# EAGLE schematic suiveur_evan (EAGLE 5.12)
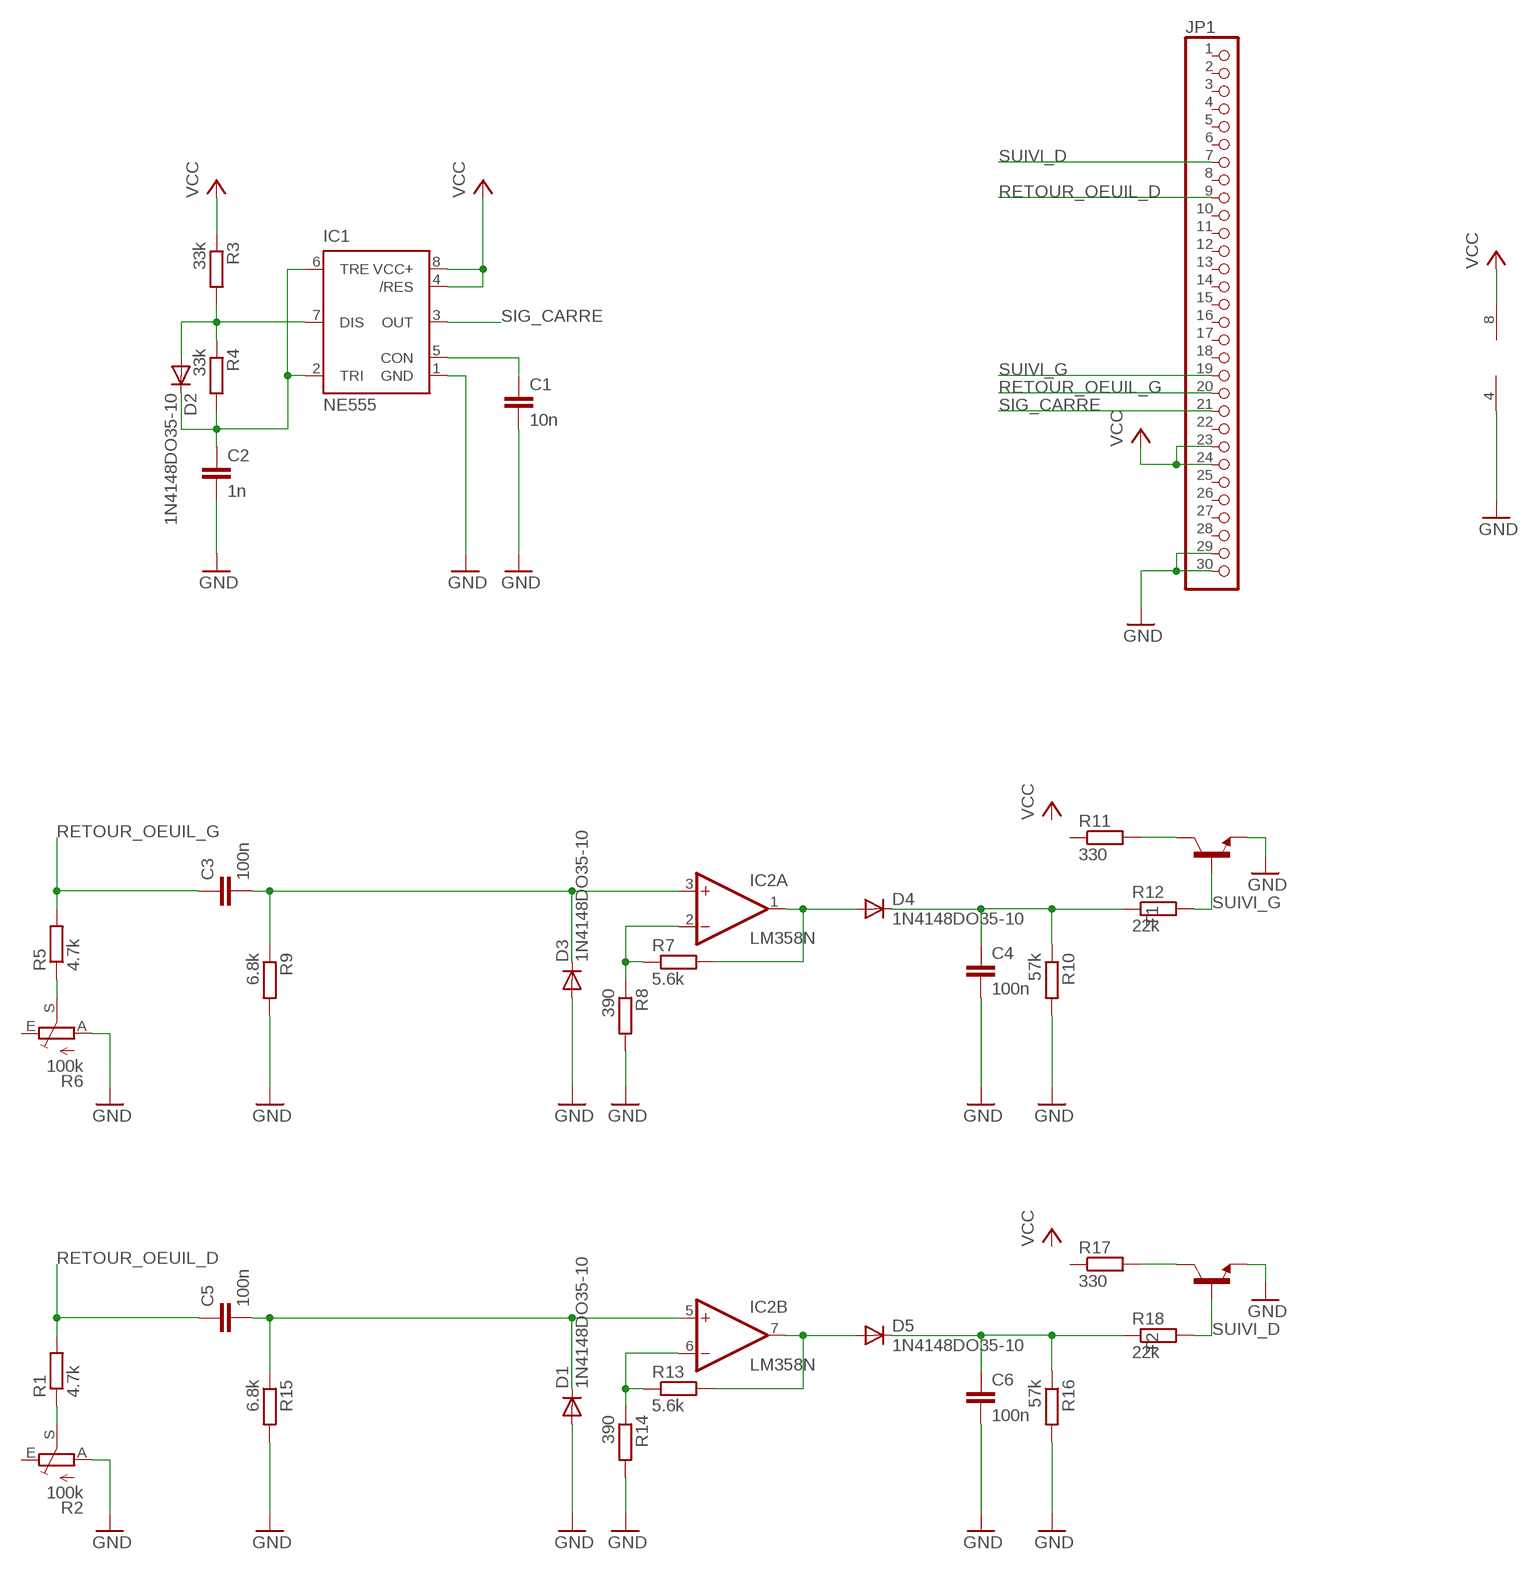
[diagram p0: schematic, sheet 1]

## Parts
C1  10n  C-EU025-025X050  [C025-025X050]
C2  1n  C-EU102-043X133  [C102-043X133]
C3  100n  C-EU025-025X050  [C025-025X050]
C4  100n  C-EU025-025X050  [C025-025X050]
C5  100n  C-EU025-025X050  [C025-025X050]
C6  100n  C-EU025-025X050  [C025-025X050]
D1  1N4148DO35-10  [DO35-10]
D2  1N4148DO35-10  [DO35-10]
D3  1N4148DO35-10  [DO35-10]
D4  1N4148DO35-10  [DO35-10]
D5  1N4148DO35-10  [DO35-10]
IC1  NE555  [DIL-08]
IC2  LM358N  [DIL08]
JP1  PINHD-1X30  [1X30]
R1  4.7k  R-EU_0207/12  [0207/12]
R2  100k  TRIM_EU-CA9V  [CA9V]
R3  33k  R-EU_0207/12  [0207/12]
R4  33k  R-EU_0207/12  [0207/12]
R5  4.7k  R-EU_0207/12  [0207/12]
R6  100k  TRIM_EU-CA9V  [CA9V]
R7  5.6k  R-EU_0207/12  [0207/12]
R8  390  R-EU_0207/12  [0207/12]
R9  6.8k  R-EU_0207/12  [0207/12]
R10  57k  R-EU_0207/12  [0207/12]
R11  330  R-EU_0207/12  [0207/12]
R12  22k  R-EU_0207/12  [0207/12]
R13  5.6k  R-EU_0207/12  [0207/12]
R14  390  R-EU_0207/12  [0207/12]
R15  6.8k  R-EU_0207/12  [0207/12]
R16  57k  R-EU_0207/12  [0207/12]
R17  330  R-EU_0207/12  [0207/12]
R18  22k  R-EU_0207/12  [0207/12]
T1  2N2222-NPN-TO92-EBC  [TO92-EBC]
T2  2N2222-NPN-TO92-EBC  [TO92-EBC]

## Nets
GND: C1.2 C2.2 C4.2 C6.2 D1.A D3.A IC1.1(GND) IC2.4(P:V-) JP1.29 JP1.30 R2.A R6.A R8.2 R9.2 R10.2 R14.2 R15.2 R16.2 T1.E T2.E
N$2: D2.A IC1.7(DIS) R3.2 R4.1
N$3: C2.1 D2.C IC1.2(TRI) IC1.6(TRE) R4.2
N$4: C1.1 IC1.5(CON)
N$5: C5.2 D1.C IC2.5(B:+IN) R15.1
N$6: IC2.6(B:-IN) R13.1 R14.1
N$7: C3.2 D3.C IC2.3(A:+IN) R9.1
N$8: IC2.2(A:-IN) R7.1 R8.1
N$9: D4.A IC2.1(A:OUT) R7.2
N$10: R5.1 R6.S
N$11: C4.1 D4.C R10.1 R12.1
N$12: D5.A IC2.7(B:OUT) R13.2
N$13: R1.1 R2.S
N$14: R11.2 T1.C
N$15: C6.1 D5.C R16.1 R18.1
N$16: R17.2 T2.C
RETOUR_OEUIL_D: C5.1 JP1.9 R1.2
RETOUR_OEUIL_G: C3.1 JP1.20 R5.2
SIG_CARRE: IC1.3(OUT) JP1.21
SUIVI_D: JP1.7 R18.2 T2.B
SUIVI_G: JP1.19 R12.2 T1.B
VCC: IC1.4(/RES) IC1.8(VCC+) IC2.8(P:V+) JP1.23 JP1.24 R3.1
Unconnected: JP1.1 JP1.2 JP1.3 JP1.4 JP1.5 JP1.6 JP1.8 JP1.10 JP1.11 JP1.12 JP1.13 JP1.14 JP1.15 JP1.16 JP1.17 JP1.18 JP1.22 JP1.25 JP1.26 JP1.27 JP1.28 R2.E R6.E R11.1 R17.1

## Library data of the parts
C1-C6 = resistor:C-EU: CAPACITOR, European symbol
D1-D5 = diode:1N4148: DIODE high speed (Philips)
IC1 = st-microelectronics:NE555: General purpose bipolar Timer; MF: Arrow Electronics; MPN: NE555N; OC_FARNELL: 1467742; OC_NEWARK: 89K1486
IC2 = linear:LM358: OP AMP also LM158; LM258; LM2904 Source: http://cache.national.com/ds/LM/LM158.pdf
JP1 = pinhead:PINHD-1X30: PIN HEADER
R1 R3-R5 R7-R18 = resistor:R-EU_: RESISTOR, European symbol
R2 R6 = pot:TRIM_EU-: POTENTIOMETER
T1 T2 = transistor-neu-to92:*-NPN-: NPN Transistror